# EAGLE design AlienWhoopRx (EAGLE 9.0.0)
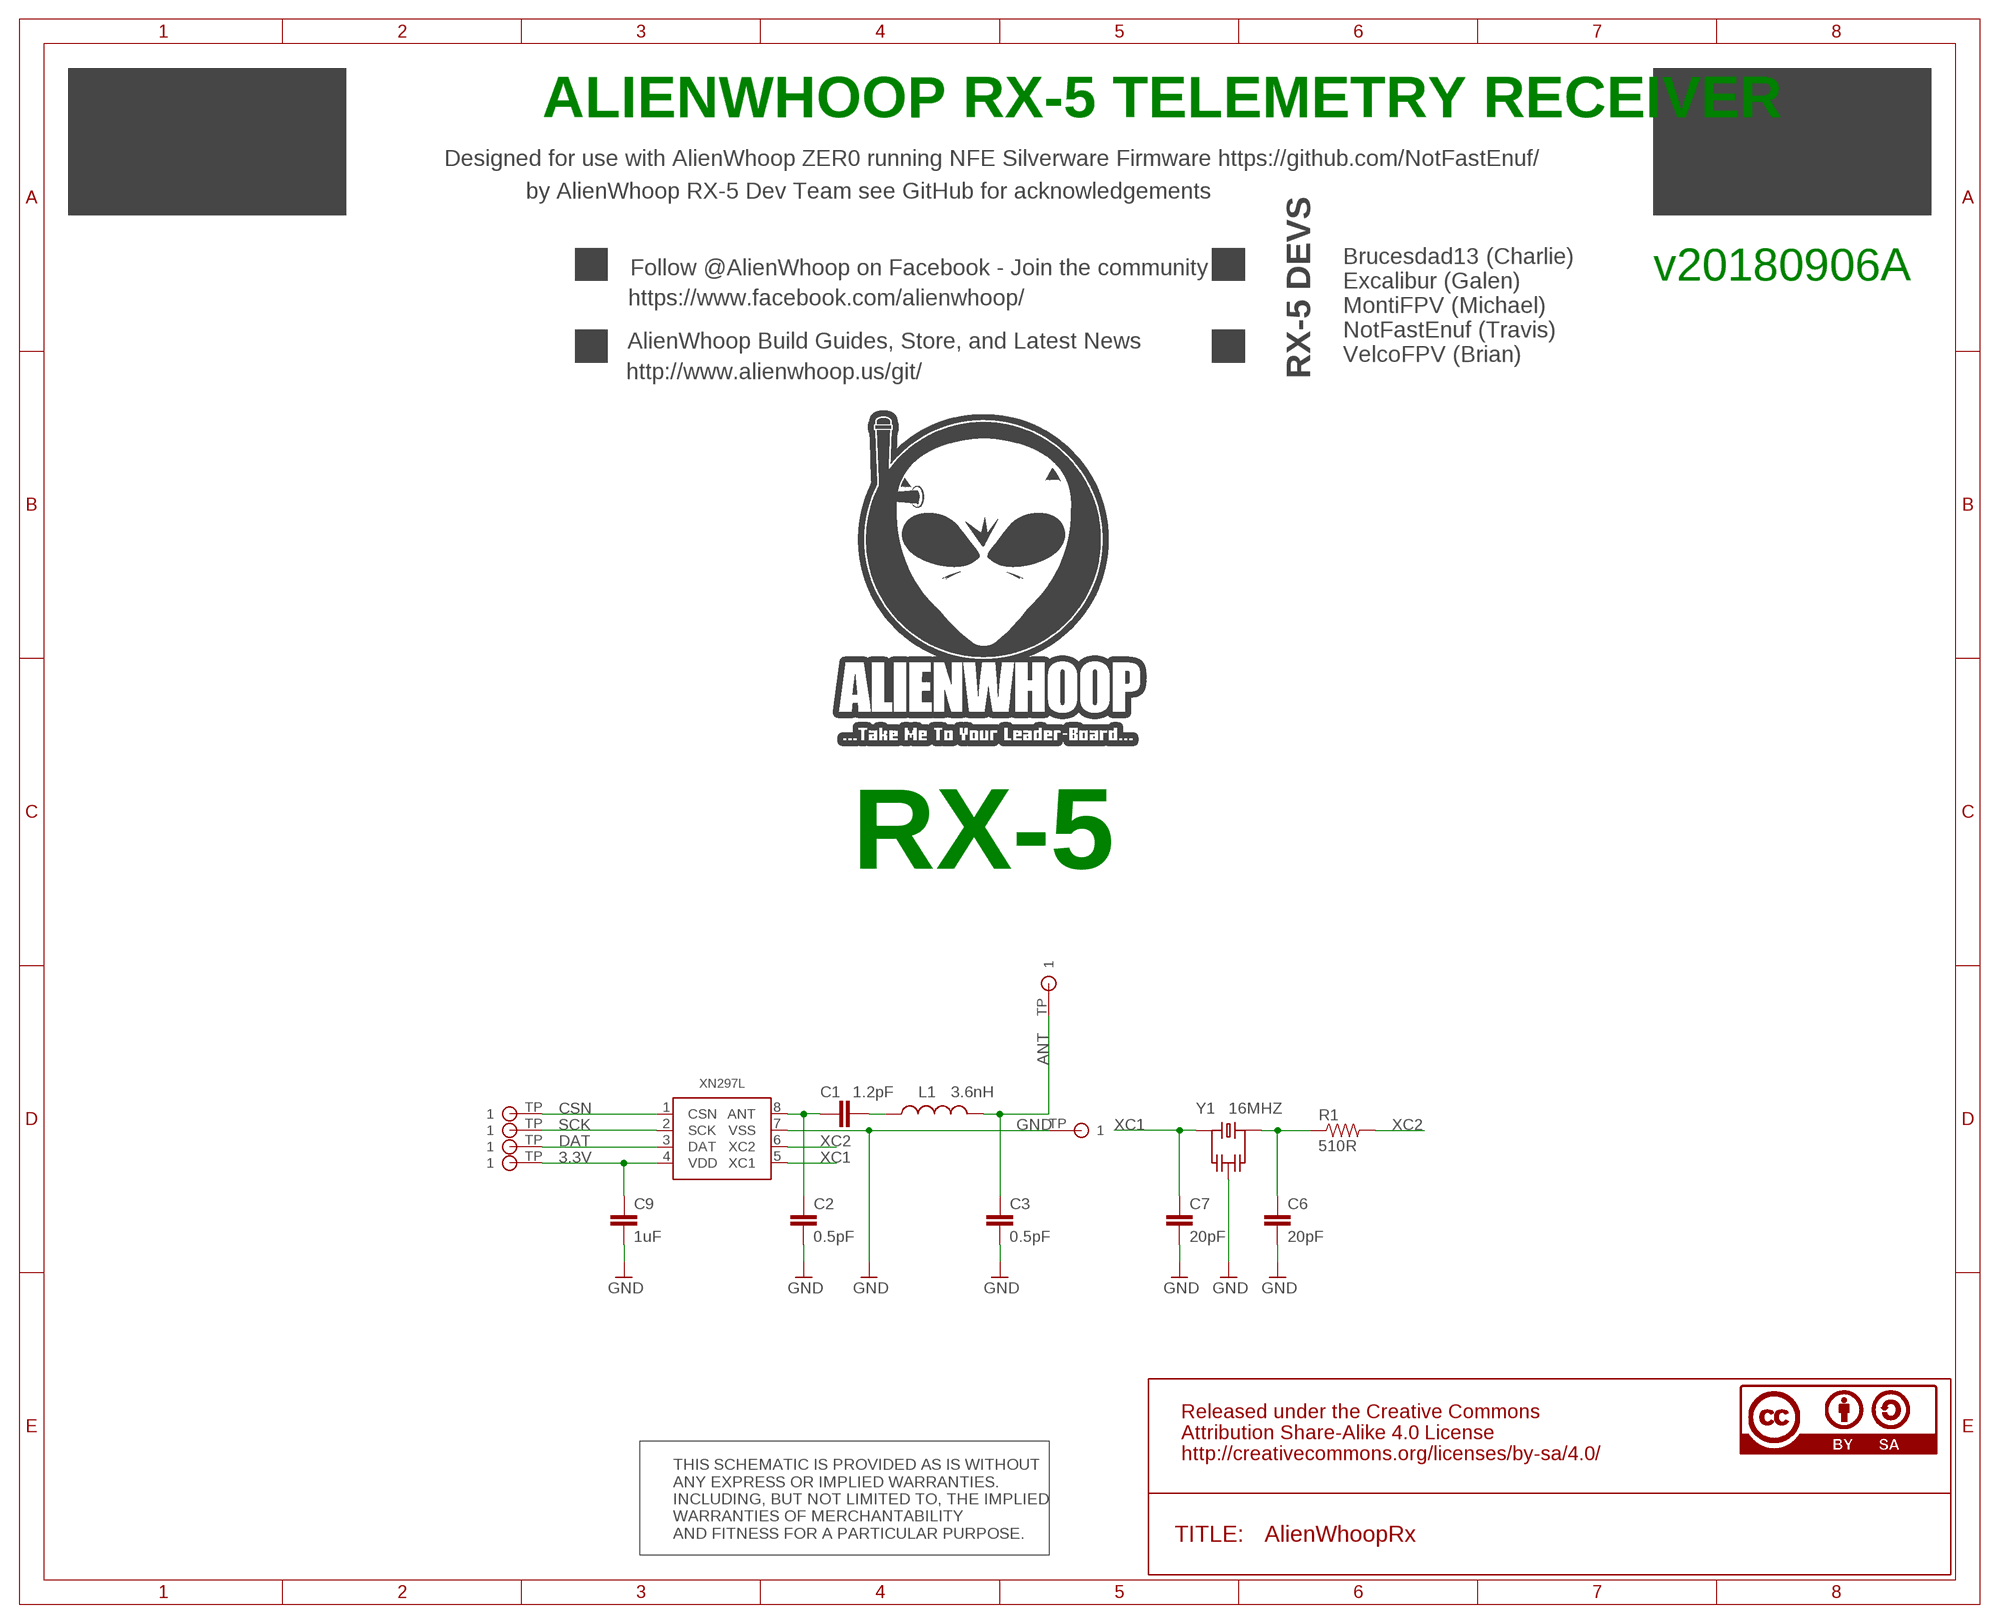
[diagram p0: schematic, sheet 1]

## Parts
3.3V2  TESTPAD  [TESTPAD]
C1  1.2pF  CAP_0402  [0402]
C2  0.5pF  CAP_0402  [0402]
C3  0.5pF  CAP_0402  [0402]
C6  20pF  CAP_0402  [0402]
C7  20pF  CAP_0402  [0402]
C9  1uF  CAP_0402  [0402]
GND23  TESTPAD  [TESTPAD]
L1  3.6nH  MHQ1005P3.6NH  [0402]
R1  510R  RES_0402  [0402]
SPI_CS  TESTPAD  [TESTPAD]
U1  XN297L  [SOP8L]
U$6  TESTPAD  [TESTPAD]
U$13  TESTPAD  [TESTPAD]
U$14  TESTPAD  [TESTPAD]
Y1  16MHZ  ECS-160-20-33-CKM-TR16MHZ  [ECS-160-20-33-CKM-TR]

## Nets
3.3V: 3.3V2.TP C9.1 U1.4(VDD)
ANT: C3.1 L1.2 U$6.TP
ANT_CAP: C1.2 L1.1
ANT_OUT: C1.1 C2.1 U1.8(ANT)
CSN: SPI_CS.TP U1.1(CSN)
DAT: U1.3(DAT) U$14.TP
GND: C2.2 C3.2 C6.2 C7.2 C9.2 GND23.TP U1.7(VSS) Y1.2 Y1.4
SCK: U1.2(SCK) U$13.TP
XC1: C7.1 U1.5(XC1) Y1.1
XC2: R1.2 U1.6(XC2)
XC2R: C6.1 R1.1 Y1.3

## Notes on the sheet
- ALIENWHOOP RX-5 TELEMETRY RECEIVER
- Designed for use with AlienWhoop ZER0 running NFE Silverware Firmware https://github.com/NotFastEnuf/
- by AlienWhoop RX-5 Dev Team see GitHub for acknowledgements
- Follow @AlienWhoop on Facebook - Join the community | v20180906A
- https://www.facebook.com/alienwhoop/
- AlienWhoop Build Guides, Store, and Latest News
- Brucesdad13 (Charlie)
  Excalibur (Galen)
  MontiFPV (Michael)
  NotFastEnuf (Travis)
  VelcoFPV (Brian)
- http://www.alienwhoop.us/git/ | RX-5 DEVS
- RX-5
- THIS SCHEMATIC IS PROVIDED AS IS WITHOUT
  ANY EXPRESS OR IMPLIED WARRANTIES.
  INCLUDING, BUT NOT LIMITED TO, THE IMPLIED 
  WARRANTIES OF MERCHANTABILITY
  AND FITNESS FOR A PARTICULAR PURPOSE.

## Library data of the parts
3.3V2 GND23 SPI_CS U$6 U$13 U$14 = AlienWhoop:TESTPAD: Test pad also can be used for tiny solder pad for signal; BOM: EXCLUDE; DNP: T
C1 = Perfect_0402:CAP_0402: 0402 (1005 Metric) Nick Garner - TeleSense; PARTNO: 0402YA1R2CAT2A
C2 C3 = Perfect_0402:CAP_0402: 0402 (1005 Metric) Nick Garner - TeleSense; PARTNO: VJ0402A0R5BXJCW1BC
C6 C7 = Perfect_0402:CAP_0402: 0402 (1005 Metric) Nick Garner - TeleSense; PARTNO: GJM1555C1H200FB01D
C9 = Perfect_0402:CAP_0402: 0402 (1005 Metric) Nick Garner - TeleSense; PARTNO: GRM155C71A105KE11D
L1 = alienflight:MHQ1005P: TDK MHQ1005P Fixed Inductor; PARTNO: MHQ1005P3N6ST000
R1 = Perfect_0402:RES_0402: 0402 (1005 Metric) Nick Garner - TeleSense; PARTNO: CR0402-FX-5100GLF
U1 = AlienWhoop:XN297L: XN297L 2.4GHz by Panchip; PARTNO: XN297LBW
Y1 = AlienWhoop:ECS-160-20-33-CKM-TR: The ECS-160-20-33-CKM-TR is a miniature SMD Crystal with a 3.2 x 2.5 mm footprint.; PARTNO: ECS-160-20-33-CKM-TR

## Board
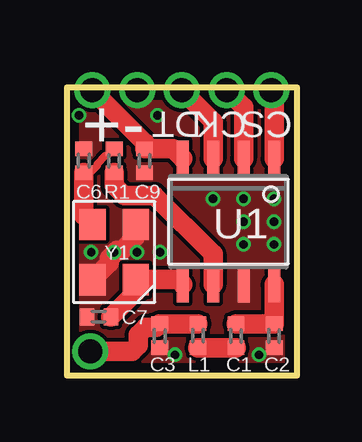
[diagram p1: board, top side]
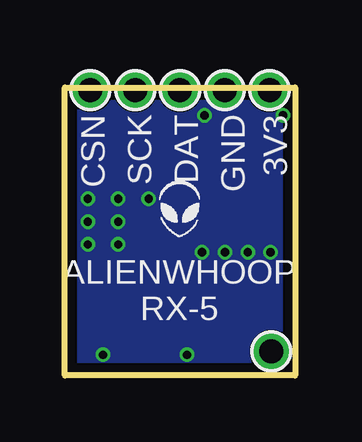
[diagram p2: board, bottom side, seen from below]

Size 9.59 x 12.01 mm. Coordinates in mm from the lower left corner, seen from the top.
Outline: 0,12.01 0,0 9.59,0 9.59,12.01 0,12.01
Copper layers (1*16): Top 0.035559375mm / dielectric 1.6mm / Bottom 0.035559375mm
Design rules "oshpark-2layer *": minimum track width 6mil, minimum drill 10mil, track to track 6mil, track to pad 6mil, pad to pad 6mil, via to via 6mil, smd to smd 6mil, copper to edge 15mil, drill to drill 6mil, minimum pad ring 5mil, minimum via ring 5mil, stop-mask expansion 2.5mil, vias tented up to drill 23mil, thermal gap 10mil

### Footprints (pad centres in the part's own frame; a part is rotated, then mirrored left to right if it is on the bottom)
TESTPAD = smd 1.27 x 1.27: TP 0,0
0402 = smd 0.6 x 0.7: 1 -0.5,0; 2 0.5,0
SOP8L = smd 0.5 x 1.5: 1 -1.905,-2.625; 2 -0.635,-2.625; 3 0.635,-2.625; 4 1.905,-2.625; 5 1.905,2.625; 6 0.635,2.625; 7 -0.635,2.625; 8 -1.905,2.625
ECS-160-20-33-CKM-TR = smd 1.3 x 1.1: 1 -1.15,-0.9; 2 1.15,-0.9; 3 1.15,0.9; 4 -1.15,0.9

### Placement (x,y rotation side)
3.3V2  1.07,11.89 0 top
C1  7.05,1.66 270 top
C2  8.64,1.66 270 top
C3  3.88,1.66 270 top
C6  0.7,8.96 90 top
C7  1.34,2.45 180 top
C9  3.24,8.96 270 top
GND23  2.93,11.89 0 top
L1  5.47,1.66 90 top
R1  1.97,8.96 270 top
SPI_CS  8.53,11.89 0 top
U1  6.74,6.42 180 top
U$6  0.99,1 0 top
U$13  6.66,11.89 0 top
U$14  4.8,11.89 0 top
Y1  1.97,5.15 90 top

### Tracks (layer width: path | path; a pad name or v marks a point on that pad's centre or on a via)
3.3V  (via drill 1)
  Top 0.813: 3.3V2.TP 3.24,9.72 C9.1 4.41,9.46 U1.4
  other vias: 1.07,11.89
ANT  (via drill 1)
  Top 0.813: L1.2 C3.1 3.74,2.01 3.3,2.01 2.97,1.69 2.97,1.25 2.72,1 U$6.TP
  other vias: 0.99,1
ANT_CAP
  Top 0.813: C1.2 L1.1
ANT_OUT
  Top 0.813: U1.8 C2.1 C1.1
CSN  (via drill 1)
  Top 0.813: SPI_CS.TP 8.64,11.78 U1.1
  other vias: 8.53,11.89
DAT  (via drill 1)
  Top 0.813: U$14.TP 6.1,10.59 U1.3
  other vias: 4.8,11.89
GND  (via drill 0.35 pad 0.55, 1)
  Top 0.813: Y1.2 2.87,5.8 2.28,5.21 2.09,5.21 1.76,4.88 1.76,4.69 Y1.4
  other vias: 2.93,11.89 0.5,10.85 4.51,0.86 8,0.86 3.78,10.85 8.64,7.37 8.64,6.42 8.64,5.46 3.88,5.15 1.02,5.15 2.93,5.15 6.1,7.37 7.37,7.37 7.37,6.42 7.37,5.46 1.97,5.15
  pour Top (rank 2, no thermals): -0.88,11.98 -0.88,-0.57 10.54,-0.57 10.54,11.98
  pour Bottom (rank 2, no thermals): -1.2,12.2 -1.2,-0.89 10.86,-0.89 10.86,12.2
SCK  (via drill 1)
  Top 0.813: U$13.TP 7.37,11.19 U1.2
  other vias: 6.66,11.89
XC1
  Top 0.813: U1.5 4.62,4 Y1.1 2.87,3.48 C7.1
XC2
  Top 0.813: R1.2 1.97,7.92 2.39,7.51 3.65,7.51 6.1,5.06 U1.6
XC2R
  Top 0.305: C6.1 0.97,8.46 1.26,8.75 1.26,8.83 1.6,9.17 1.68,9.17 R1.1
  Top 0.813: Y1.3 0.7,6.67 C6.1

### Text on the board
tPlace: DT | CK | CS | + | -
bPlace: 3V3 | GND | DAT | SCK | CSN | ALIENWHOOP / RX-5